# Altium schematic sheet Dashboard - Multifunctional Probe.SchDoc
size A4; SheetNumber: 1; SheetTotal: 7
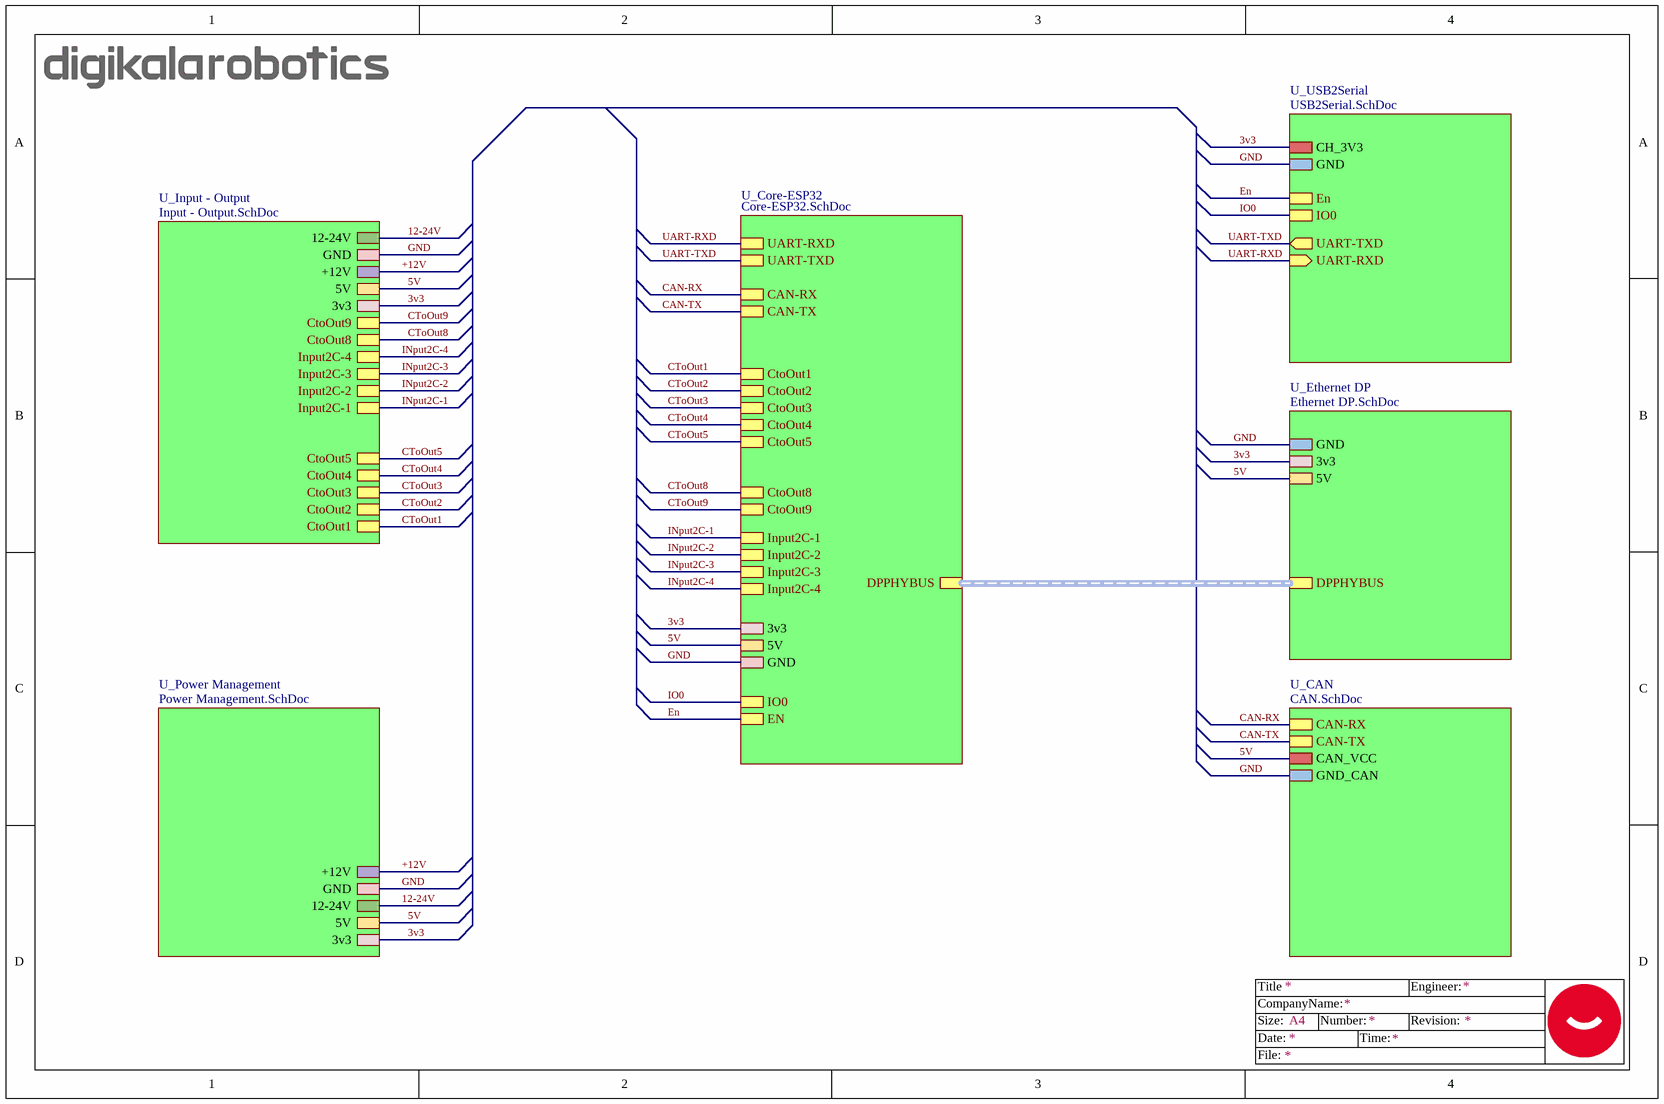
[diagram p0: Dashboard - Multifunctional Probe.SchDoc]

## Sub-sheets
U_CAN = CAN.SchDoc: CAN-RX, CAN-TX, CAN_VCC, GND_CAN
U_Core-ESP32 = Core-ESP32.SchDoc: UART-RXD, UART-TXD, DPPHYBUS (harness DPPHYBUS), CAN-RX, CAN-TX, CtoOut1, CtoOut2, CtoOut3, CtoOut4, CtoOut8, Input2C-1, Input2C-2, Input2C-3, Input2C-4, 3v3, 5V, GND, CtoOut9, IO0, EN, CtoOut5
U_Ethernet DP = Ethernet DP.SchDoc: DPPHYBUS (harness DPPHYBUS), GND, 3v3, 5V
U_Input - Output = Input - Output.SchDoc: CtoOut1, CtoOut2, CtoOut3, CtoOut4, Input2C-1, Input2C-2, Input2C-3, Input2C-4, CtoOut8, CtoOut9, 3v3, 5V, +12V, GND, 12-24V, CtoOut5
U_Power Management = Power Management.SchDoc: 3v3, 5V, 12-24V, GND, +12V
U_USB2Serial = USB2Serial.SchDoc: CH_3V3, UART-RXD (in), UART-TXD (out), GND, En, IO0

## Nets
3v3: sheet U_Core-ESP32/3v3, sheet U_Ethernet DP/3v3, sheet U_USB2Serial/CH_3V3, sheet U_Power Management/3v3, sheet U_Input - Output/3v3
5V: sheet U_CAN/CAN_VCC, sheet U_Core-ESP32/5V, sheet U_Ethernet DP/5V, sheet U_Power Management/5V, sheet U_Input - Output/5V
12-24V: sheet U_Power Management/12-24V, sheet U_Input - Output/12-24V
+12V: sheet U_Power Management/+12V, sheet U_Input - Output/+12V
CAN-RX: sheet U_CAN/CAN-RX, sheet U_Core-ESP32/CAN-RX
CAN-TX: sheet U_CAN/CAN-TX, sheet U_Core-ESP32/CAN-TX
CToOut1: sheet U_Core-ESP32/CtoOut1, sheet U_Input - Output/CtoOut1
CToOut2: sheet U_Core-ESP32/CtoOut2, sheet U_Input - Output/CtoOut2
CToOut3: sheet U_Core-ESP32/CtoOut3, sheet U_Input - Output/CtoOut3
CToOut4: sheet U_Core-ESP32/CtoOut4, sheet U_Input - Output/CtoOut4
CToOut5: sheet U_Core-ESP32/CtoOut5, sheet U_Input - Output/CtoOut5
CToOut8: sheet U_Core-ESP32/CtoOut8, sheet U_Input - Output/CtoOut8
CToOut9: sheet U_Core-ESP32/CtoOut9, sheet U_Input - Output/CtoOut9
En: sheet U_Core-ESP32/EN, sheet U_USB2Serial/En
GND: sheet U_CAN/GND_CAN, sheet U_Core-ESP32/GND, sheet U_Ethernet DP/GND, sheet U_USB2Serial/GND, sheet U_Power Management/GND, sheet U_Input - Output/GND
INput2C-1: sheet U_Core-ESP32/Input2C-1, sheet U_Input - Output/Input2C-1
INput2C-2: sheet U_Core-ESP32/Input2C-2, sheet U_Input - Output/Input2C-2
INput2C-3: sheet U_Core-ESP32/Input2C-3, sheet U_Input - Output/Input2C-3
INput2C-4: sheet U_Core-ESP32/Input2C-4, sheet U_Input - Output/Input2C-4
IO0: sheet U_Core-ESP32/IO0, sheet U_USB2Serial/IO0
UART-RXD: sheet U_Core-ESP32/UART-RXD, sheet U_USB2Serial/UART-RXD
UART-TXD: sheet U_Core-ESP32/UART-TXD, sheet U_USB2Serial/UART-TXD

## Buses and harness runs
harness sheet U_Core-ESP32/DPPHYBUS = sheet U_Ethernet DP/DPPHYBUS

## Notes on the sheet
- Title
- Size:
- Date:
- CompanyName:
- A4
- Number:
- Time:
- Revision:
- Engineer:
- File: